# Altium schematic sheet Top_Schematic_Sheet.SchDoc: H201 Monitor Board Block Diagram
size A4; DocumentNumber: 1; SheetNumber: 1; SheetTotal: 31
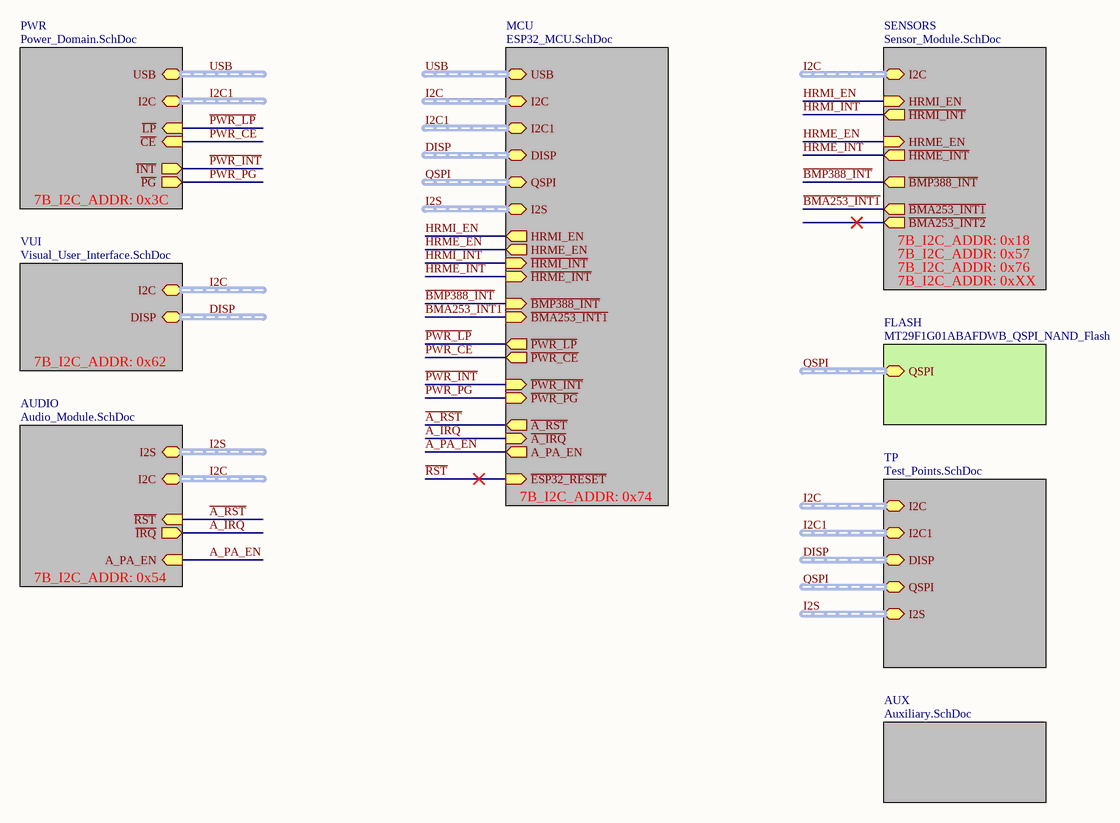
[diagram p0: Top_Schematic_Sheet.SchDoc]

## Sub-sheets
AUDIO = Audio_Module.SchDoc: I2S (harness I2S), I2C (harness I2C), ~{RST} (in), ~{IRQ} (out), A_PA_EN (in)  | 7B_I2C_ADDR: 0x54
AUX = Auxiliary.SchDoc: no entries
FLASH = MT29F1G01ABAFDWB_QSPI_NAND_Flash: QSPI (harness QSPI)
MCU = ESP32_MCU.SchDoc: ~{ESP32_RESET} (in), USB (harness USB), I2C1 (harness I2C), QSPI (harness QSPI), HRMI_EN (out), HRME_EN (out), ~{HRMI_INT} (in), ~{BMP388_INT} (in), ~{BMA253_INT1} (in), DISP (harness DISP_SPI), I2S (harness I2S), ~{PWR_LP} (out), ~{PWR_CE} (out), ~{PWR_INT} (in), ~{PWR_PG} (in), I2C (harness I2C), ~{HRME_INT} (in), ~{A_RST} (out), ~{A_IRQ} (in), A_PA_EN (out)  | 7B_I2C_ADDR: 0x74
PWR = Power_Domain.SchDoc: USB (harness USB), I2C (harness I2C), ~{LP} (in), ~{PG} (out), ~{INT} (out), ~{CE} (in)  | 7B_I2C_ADDR: 0x3C
SENSORS = Sensor_Module.SchDoc: I2C (harness I2C), ~{BMA253_INT1} (out), ~{BMP388_INT} (out), ~{BMA253_INT2} (out), ~{HRMI_INT} (out), ~{HRME_INT} (out), HRMI_EN (in), HRME_EN (in)  | 7B_I2C_ADDR: 0x57; 7B_I2C_ADDR: 0x18; 7B_I2C_ADDR: 0x76; 7B_I2C_ADDR: 0xXX
TP = Test_Points.SchDoc: I2C (harness I2C), DISP (harness DISP_SPI), QSPI (harness QSPI), I2S (harness I2S), I2C1 (harness I2C)
VUI = Visual_User_Interface.SchDoc: I2C (harness I2C), DISP (harness DISP_SPI)  | 7B_I2C_ADDR: 0x62

## Nets
~{A_IRQ}: sheet MCU/~{A_IRQ}, sheet AUDIO/~{IRQ}
~{A_RST}: sheet MCU/~{A_RST}, sheet AUDIO/~{RST}
~{BMA253_INT1}: sheet MCU/~{BMA253_INT1}, sheet SENSORS/~{BMA253_INT1}
~{BMP388_INT}: sheet MCU/~{BMP388_INT}, sheet SENSORS/~{BMP388_INT}
~{HRME_INT}: sheet MCU/~{HRME_INT}, sheet SENSORS/~{HRME_INT}
~{HRMI_INT}: sheet MCU/~{HRMI_INT}, sheet SENSORS/~{HRMI_INT}
~{PWR_CE}: sheet PWR/~{CE}, sheet MCU/~{PWR_CE}
~{PWR_INT}: sheet PWR/~{INT}, sheet MCU/~{PWR_INT}
~{PWR_LP}: sheet PWR/~{LP}, sheet MCU/~{PWR_LP}
~{PWR_PG}: sheet PWR/~{PG}, sheet MCU/~{PWR_PG}
~{RST}: sheet MCU/~{ESP32_RESET}
A_PA_EN: sheet MCU/A_PA_EN, sheet AUDIO/A_PA_EN
HRME_EN: sheet MCU/HRME_EN, sheet SENSORS/HRME_EN
HRMI_EN: sheet MCU/HRMI_EN, sheet SENSORS/HRMI_EN

## Buses and harness runs
harness DISP = sheet MCU/DISP
harness DISP = sheet TP/DISP
harness DISP = sheet VUI/DISP
harness I2C1 = sheet MCU/I2C1
harness I2C1 = sheet PWR/I2C
harness I2C1 = sheet TP/I2C1
harness I2C = sheet AUDIO/I2C
harness I2C = sheet MCU/I2C
harness I2C = sheet SENSORS/I2C
harness I2C = sheet TP/I2C
harness I2C = sheet VUI/I2C
harness I2S = sheet AUDIO/I2S
harness I2S = sheet MCU/I2S
harness I2S = sheet TP/I2S
harness QSPI = sheet FLASH/QSPI
harness QSPI = sheet MCU/QSPI
harness QSPI = sheet TP/QSPI
harness USB = sheet MCU/USB
harness USB = sheet PWR/USB

## Notes on the sheet
- Title
- Size:
- Date:
- A4
- Number:
- Time:
- Revision:
- Sheet
- of
- File: